# Altium schematic sheet Buffers.SchDoc
size A; SheetNumber: 3; SheetTotal: 3
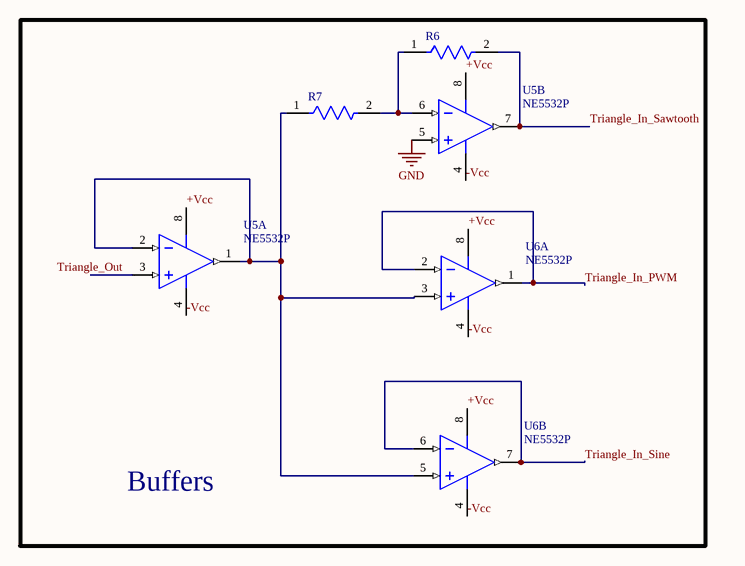
[diagram p0: Buffers.SchDoc]

## Parts
R6  (no value)  [FP-VR37-MFG]
R7  (no value)  [FP-VR37-MFG]
U5  NE5532P  [P0008A]  (parts A,B of 2)
U6  NE5532P  [P0008A]  (parts A,B of 2)

## Blocks framed on the sheet
Buffers: R6 R7 U5 U6

## Nets
GND: U5.5(IN2+)
+Vcc: U5.8(VCC+) U6.8(VCC+)
-Vcc: U5.4(VCC-) U6.4(VCC-)
Triangle_In_PWM: U6.1(OUT1) U6.2(IN1-)
Triangle_In_Sawtooth: R6.2 U5.7(OUT2)
Triangle_In_Sine: U6.6(IN2-) U6.7(OUT2)
Triangle_Out: U5.3(IN1+)
NetR6_1: R6.1 R7.2 U5.6(IN2-)
NetR7_1: R7.1 U5.1(OUT1) U5.2(IN1-) U6.3(IN1+) U6.5(IN2+)

## Library data of the parts
R6 R7 = CMP-02408-000054-1: RES 1.2M OHM 5% 1/2W AXIAL; Voltage Rating: 3.5kV; Power Rating: 500mW; Temperature Coefficient: 200ppm/°C; Resistance: 1.2MR; Diameter: 4mm; Max Operating Temperature: 155°C; Military Standard: Not; Reach SVHC Compliant: Yes; Min Operating Temperature: -55°C; Resistance Tolerance: 5%; Resistor Type: Metal Film; Tolerance: 5%; Mount: Through Hole; Construction: Cylindrical; Contact Plating: Tin; Length: 10mm; Termination: Axial; Voltage Rating (DC): 3.5kV; Packaging: Ammo Pack; Radiation Hardening: No; Case/Package: Conformal
U5 U6 = CMP-0017-00910-2: Dual Low-Noise High-Speed Audio Operational Amplifier, 10 to 30 V, 0 to 70 degC, 8-pin DIP (P8), Pb-Free (RoHS); Manufacturer: Texas Instruments; Iq per channel(Max)(mA): 4; Slew Rate(Typ)(V/us): 9; Vn at 1kHz(Typ)(nV/rtHz): 5; IIB(Max)(pA): 800000; Total Supply Voltage(Max)(+5V is 5, +/-5V is 10): 30; GBW(Typ)(MHz): 10; CMRR(Min)(dB): 70; Number of Channels: 2; Sub Family: General Purpose Amplifier, High Supply Voltage Amplifier (>=30V), Low Noise Amp (<=10nV/rtHz); ComponentLink2URL: http://www.ti.com/lit/ds/symlink/ne5532.pdf; PackageReference: P0008A; PackageDescription: 8-Pin Plastic In-Line, Body 9.59 x 6.35 mm, Pitch 2.54 mm; ComponentLink1Description: Manufacturer URL; Eco-Plan: Pb-Free (RoHS); Mounting Technology: Through Hole; Code_JEDEC: MS-001; PackageVersion: 4040082/E, 04/2010; DatasheetVersion: SLOS075I; ComponentLink3URL: http://www.ti.com/litv/pdf/mpdi001b; ComponentLink2Description: Datasheet; Vio (25C)(Max)(mV): 4; PartNumber: NE5532P; ComponentLink3Description: Package Specification; Total Supply Voltage(Min)(+5V is 5, +/-5V is 10): 10; ComponentLink1URL: http://www.ti.com/